# EAGLE design HA_CrankPhone (EAGLE 9.6.1)
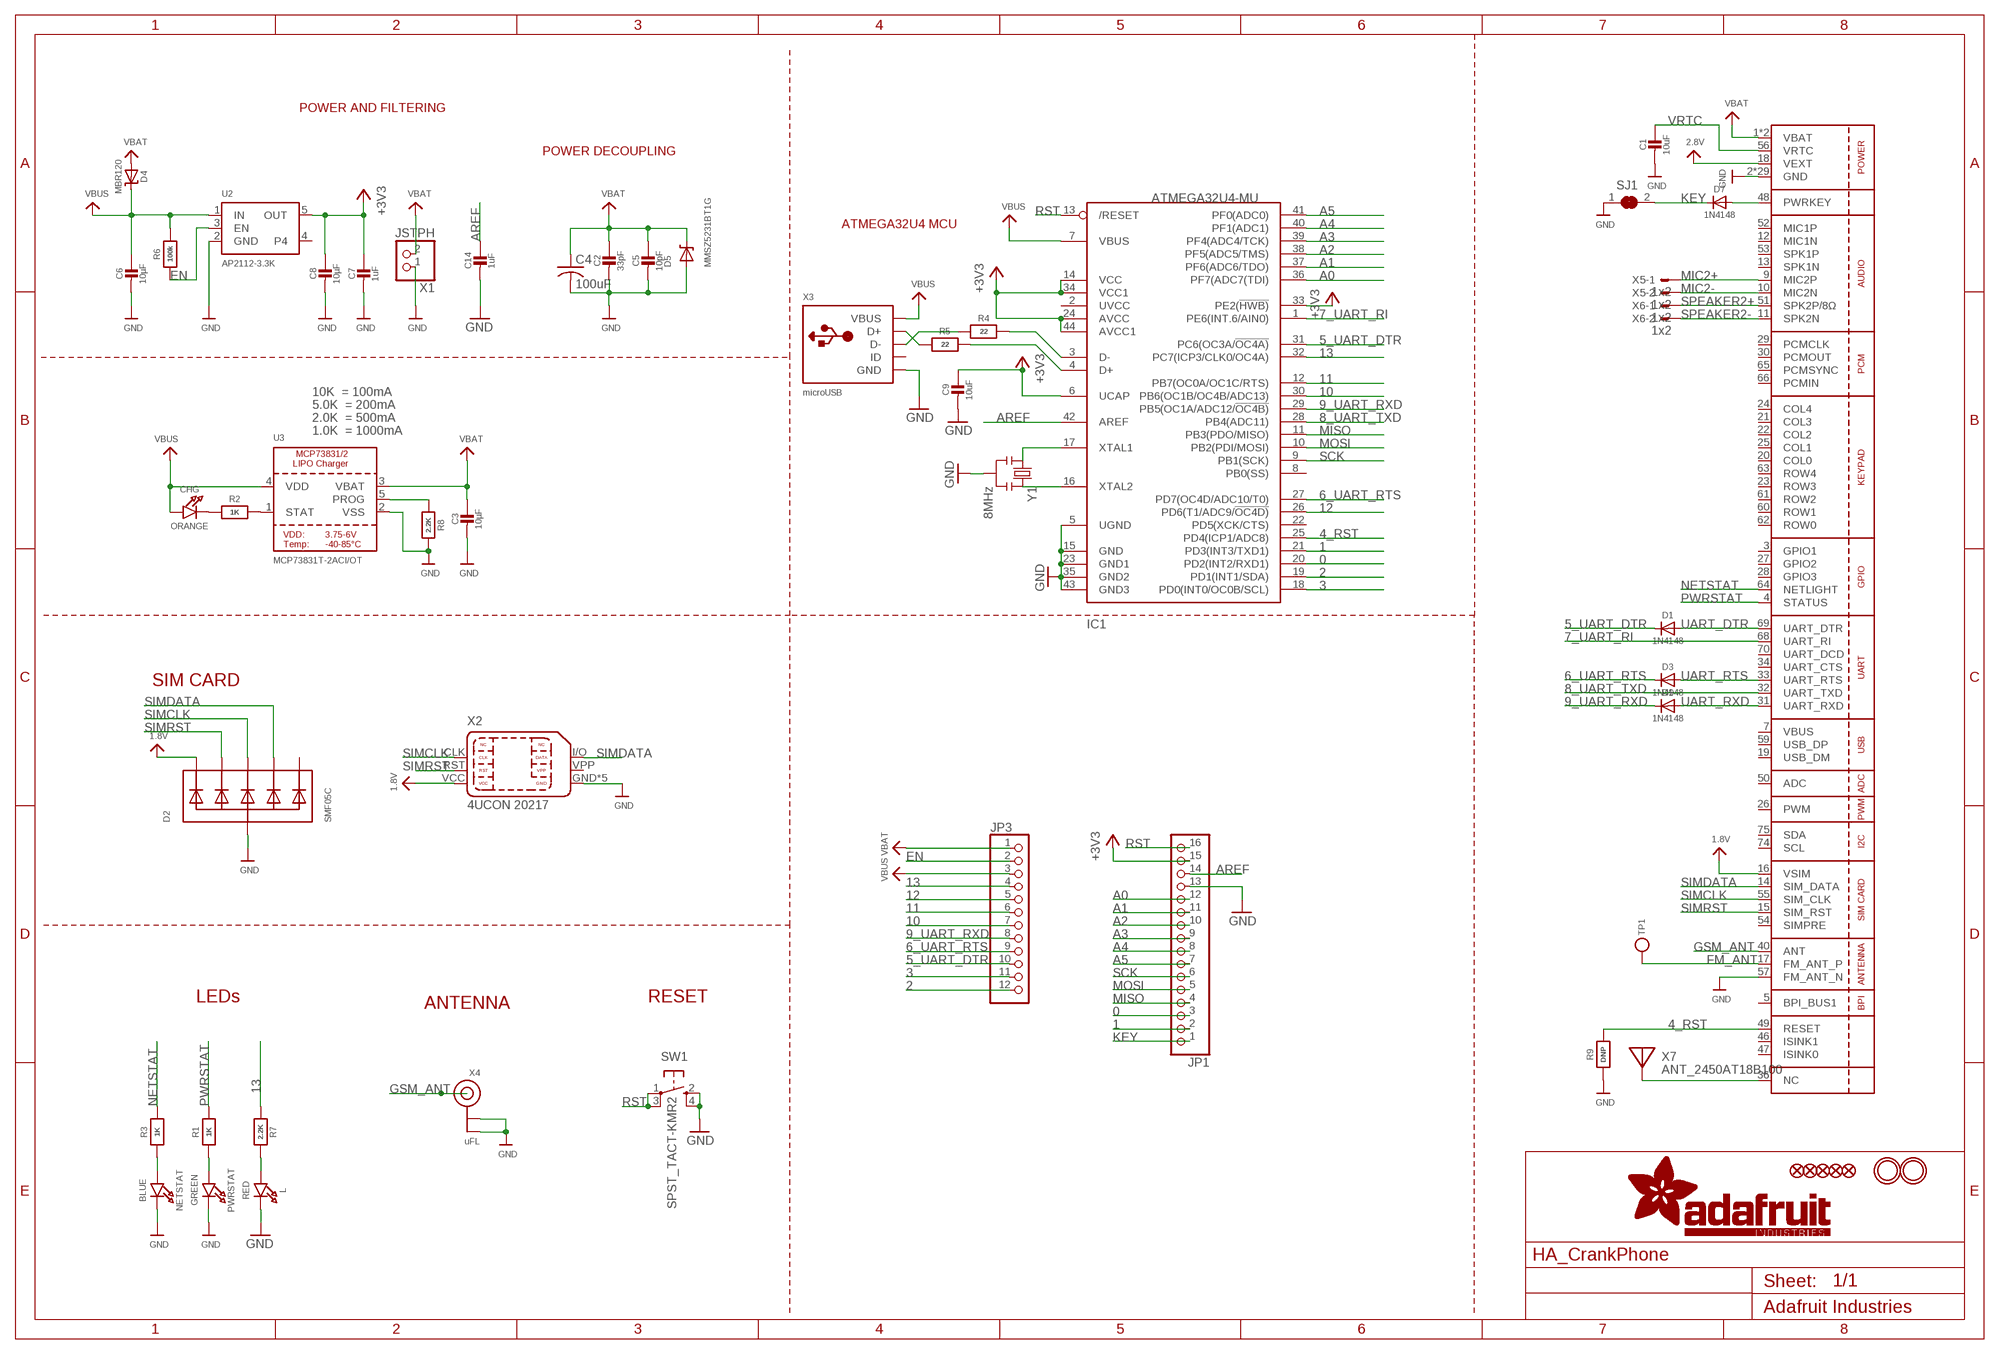
[diagram p0: schematic, sheet 1]

## Parts
C1  10uF  CAP_CERAMIC_0805MP  [_0805MP]
C2  33pF  CAP_CERAMIC0805-NOOUTLINE  [0805-NO]
C3  10µF  CAP_CERAMIC0805-NOOUTLINE  [0805-NO]
C4  100uF  C-USC1210  [C1210]
C5  10pF  CAP_CERAMIC0805-NOOUTLINE  [0805-NO]
C6  10µF  CAP_CERAMIC0805-NOOUTLINE  [0805-NO]
C7  1uF  CAP_CERAMIC0603_NO  [0603-NO]
C8  10µF  CAP_CERAMIC0805-NOOUTLINE  [0805-NO]
C9  10uF  CAP_CERAMIC_0805MP  [_0805MP]
C14  1uF  CAP_CERAMIC0603_NO  [0603-NO]
CHG  ORANGE  LED0805_NOOUTLINE  [CHIPLED_0805_NOOUTLINE]
D1  1N4148  DIODESOD-323  [SOD-323]
D2  SMF05C  TVSARRAY_5LANE  [SOT363]
D3  1N4148  DIODESOD-323  [SOD-323]
D4  MBR120  DIODE-SCHOTTKYSOD-123  [SOD-123]
D5  MMSZ5231BT1G  DIODE-ZENERSOD123  [SOD-123]
D7  1N4148  DIODESOD-323  [SOD-323]
D9  1N4148  DIODESOD-323  [SOD-323]
IC1  ATMEGA32U4-MU  [TQFN44_7MM]
JP1  HEADER-1X16ROUND  [1X16_ROUND]
JP3  HEADER-1X12  [1X12_ROUND]
L  RED  LED0805_NOOUTLINE  [CHIPLED_0805_NOOUTLINE]
NETSTAT  BLUE  LED0805_NOOUTLINE  [CHIPLED_0805_NOOUTLINE]
PWRSTAT  GREEN  LED0805_NOOUTLINE  [CHIPLED_0805_NOOUTLINE]
R1  1K  RESISTOR_0603_NOOUT  [0603-NO]
R2  1K  RESISTOR_0603_NOOUT  [0603-NO]
R3  1K  RESISTOR_0603_NOOUT  [0603-NO]
R4  22  RESISTOR_0603_NOOUT  [0603-NO]
R5  22  RESISTOR_0603_NOOUT  [0603-NO]
R6  100k  RESISTOR_0603_NOOUT  [0603-NO]
R7  2.2K  RESISTOR_0603_NOOUT  [0603-NO]
R8  2.2K  RESISTOR_0603_NOOUT  [0603-NO]
R9  DNP  RESISTOR_0603_NOOUT  [0603-NO]
SJ1  SOLDERJUMPER_CLOSED  [SOLDERJUMPER_CLOSEDWIRE]
SW1  SPST_TACT-KMR2  [KMR2]
TP1  TESTPOINTROUND1.5MM  [TESTPOINT_ROUND_1.5MM]
U1  SIM800H/L  GSM_SIM800L  [SIM800L]
U2  AP2112-3.3K  VREG_SOT23-5  [SOT23-5]
U3  MCP73831T-2ACI/OT  MCP73831/2  [SOT23-5]
U$18  FIDUCIAL""  [FIDUCIAL_1MM]
U$23  FIDUCIAL""  [FIDUCIAL_1MM]
U$31  MOUNTINGHOLE2.5  [MOUNTINGHOLE_2.5_PLATED]
U$32  MOUNTINGHOLE2.5  [MOUNTINGHOLE_2.5_PLATED]
U$34  FIDUCIAL""  [FIDUCIAL_1MM]
U$35  FIDUCIAL""  [FIDUCIAL_1MM]
U$42  FIDUCIAL""  [FIDUCIAL_1MM]
X1  JSTPH  CON_JST_PH_2PIN  [JSTPH2]
X2  4UCON 20217  SIM_MICRO  [4UCONN_20217]
X3  microUSB  USB_MICRO_20329_V2  [4UCONN_20329_V2]
X4  uFL  ANTENNA_U.FL  [U.FL]
X5  1x2  87758-0216  [87758-0216]
X6  1x2  87758-0216  [87758-0216]
X7  ANT_2450AT18B100  ANTENNA_JOHANSON_2450AT18B100  [ANT_2450AT18B100]
Y1  8MHz  RESONATORSMD  [RESONATOR-SMD]

## Nets
0: IC1.20(PD2(INT2/RXD1)) JP1.3
1: IC1.21(PD3(INT3/TXD1)) JP1.2
1.8V: D2.1(C1) U1.16(VSIM) X2.VCC
2: IC1.19(PD1(INT1/SDA)) JP3.12
2.8V: U1.18(VEXT)
3: IC1.18(PD0(INT0/OC0B/SCL)) JP3.11
4_RST: IC1.25(PD4(ICP1/ADC8)) R9.2 U1.49(RESET)
5_UART_DTR: D1.C IC1.31(PC6(OC3A/!OC4A)) JP3.10
6_UART_RTS: D3.C IC1.27(PD7(OC4D/ADC10/T0)) JP3.9
7_UART_RI: IC1.1(PE6(INT.6/AIN0)) U1.68(UART_RI)
8_UART_TXD: IC1.28(PB4(ADC11)) U1.32(UART_TXD)
9_UART_RXD: D9.C IC1.29(PB5(OC1A/ADC12/!OC4B)) JP3.8
10: IC1.30(PB6(OC1B/OC4B/ADC13)) JP3.7
11: IC1.12(PB7(OC0A/OC1C/RTS)) JP3.6
12: IC1.26(PD6(T1/ADC9/!OC4D)) JP3.5
13: IC1.32(PC7(ICP3/CLK0/OC4A)) JP3.4 R7.1
+3V3: C7.1 C8.1 C9.1 IC1.6(UCAP) IC1.14(VCC) IC1.24(AVCC) IC1.33(PE2(!HWB)) IC1.34(VCC1) IC1.44(AVCC1) JP1.15 U2.5(OUT)
A0: IC1.36(PF7(ADC7(TDI)) JP1.12
A1: IC1.37(PF6(ADC6/TDO)) JP1.11
A2: IC1.38(PF5(ADC5/TMS)) JP1.10
A3: IC1.39(PF4(ADC4/TCK)) JP1.9
A4: IC1.40(PF1(ADC1)) JP1.8
A5: IC1.41(PF0(ADC0)) JP1.7
AREF: C14.1 IC1.42(AREF) JP1.14
D+: IC1.4(D+) R5.2
D-: IC1.3(D-) R4.2
EN: JP3.2 R6.1 U2.3(EN)
FM_ANT: TP1.P$1 U1.17(FM_ANT_P)
GND: C1.2 C2.2 C3.2 C4.2 C5.2 C6.2 C7.2 C8.2 C9.2 C14.2 D2.2(A) D5.A IC1.5(UGND) IC1.15(GND) IC1.23(GND1) IC1.35(GND2) IC1.43(GND3) JP1.13 L.C NETSTAT.C PWRSTAT.C R8.2 R9.1 SJ1.1 SW1.2(S) SW1.4(S1) U1.2(GND) U1.6(GND) U1.8(GND) U1.35(GND) U1.37(GND) U1.38(GND) U1.39(GND) U1.41(GND) U1.43(GND) U1.44(GND) U1.45(GND) U1.57(FM_ANT_N) U1.58(GND) U1.67(GND) U1.71(GND) U1.72(GND) U1.73(GND) U1.76(GND) U1.77(GND) U1.78(GND) U1.79(GND) U1.80(GND) U1.81(GND) U1.82(GND) U1.83(GND) U1.84(GND) U1.85(GND) U1.86(GND) U1.87(GND) U1.88(GND) U2.2(GND) U3.2(VSS) X1.1 X2.GND X2.GND@1(GND) X2.GND@2(GND) X2.GND@3(GND) X2.GND@4(GND) X3.BASE@1(GND) X3.BASE@2(GND) X3.GND X3.SPRT@1(GND) X3.SPRT@2(GND) X3.SPRT@3(GND) X3.SPRT@4(GND) X4.1(GND) X4.2(GND) Y1.2
GSM_ANT: U1.40(ANT) X4.3(SIGNAL)
KEY: D7.C JP1.1 SJ1.2
MIC2+: U1.9(MIC2P) X5.1
MIC2-: U1.10(MIC2N) X5.2
MISO: IC1.11(PB3(PDO/MISO)) JP1.4
MOSI: IC1.10(PB2(PDI/MOSI)) JP1.5
N$1: CHG.C R2.1
N$2: L.A R7.2
N$3: R2.2 U3.1(STAT)
N$4: R8.1 U3.5(PROG)
N$5: PWRSTAT.A R1.1
N$6: U1.36(NC) X7.FP
N$7: D7.A U1.48(PWRKEY)
N$9: NETSTAT.A R3.1
N$11: IC1.16(XTAL2) Y1.3
N$12: IC1.17(XTAL1) Y1.1
N$15: R5.1 X3.D+
N$16: R4.1 X3.D-
NETSTAT: R3.2 U1.64(NETLIGHT)
PWRSTAT: R1.2 U1.4(STATUS)
RST: IC1.13(/RESET) JP1.16 SW1.1(P) SW1.3(P1)
SCK: IC1.9(PB1(SCK)) JP1.6
SIMCLK: D2.4(C3) U1.55(SIM_CLK) X2.CLK
SIMDATA: D2.5(C4) U1.14(SIM_DATA) X2.I/O(DATA)
SIMRST: D2.3(C2) U1.15(SIM_RST) X2.RST
SPEAKER2+: U1.51(SPK2P/8Ω) X6.1
SPEAKER2-: U1.11(SPK2N) X6.2
UART_DTR: D1.A U1.69(UART_DTR)
UART_RTS: D3.A U1.33(UART_RTS)
UART_RXD: D9.A U1.31(UART_RXD)
VBAT: C2.1 C3.1 C4.1 C5.1 D4.A D5.C JP3.1 U1.1(VBAT) U1.42(VBAT) U3.3(VBAT) X1.2
VBUS: C6.1 CHG.A D4.C IC1.7(VBUS) JP3.3 R6.2 U2.1(IN) U3.4(VDD) X3.VBUS
VRTC: C1.1 U1.56(VRTC)
Unconnected: D2.6(C5) IC1.2(UVCC) IC1.8(PB0(SS)) IC1.22(PD5(XCK/CTS)) U1.3(GPIO1) U1.5(BPI_BUS1) U1.12(MIC1N) U1.13(SPK1N) U1.19(USB_DM) U1.20(COL0) U1.21(COL3) U1.22(COL2) U1.23(ROW3) U1.24(COL4) U1.25(COL1) U1.26(PWM) U1.27(GPIO2) U1.28(GPIO3) U1.29(PCMCLK) U1.30(PCMOUT) U1.34(UART_CTS) U1.46(ISINK1) U1.47(ISINK0) U1.50(ADC) U1.52(MIC1P) U1.53(SPK1P) U1.54(SIMPRE) U1.59(USB_DP) U1.60(ROW1) U1.61(ROW2) U1.62(ROW0) U1.63(ROW4) U1.65(PCMSYNC) U1.66(PCMIN) U1.70(UART_DCD) U1.74(SCL) U1.75(SDA) U2.4 X2.VPP X3.ID

## Notes on the sheet
- POWER AND FILTERING
- POWER DECOUPLING
- ATMEGA32U4 MCU
- 10K  = 100mA
- 5.0K  = 200mA
- 2.0K  = 500mA
- 1.0K  = 1000mA
- SIM CARD
- LEDs | ANTENNA | RESET

## Power pins joined to a net without a drawn wire
VBUS: U1.7(VBUS)

## Library data of the parts
C1-C3 C5-C9 C14 = microbuilder:CAP_CERAMIC: Ceramic Capacitors For new designs, use the packages preceded by an '_' character since they are more reliable: The following footprints should be used on most boards: _0402 - Standard footprint for regular board layouts _0603 - Standard footprint for regular board layouts _0805 - Standard footprint for regular board layouts _1206 - Standard footprint for regular board layouts For extremely tight-pitch boards where space is at a premium, the following 'micro-pitch' footprints can be used (smaller pads, no silkscreen outline, etc.): _0402MP - Micro-pitch footprint for very dense/compact boards _0603MP - Micro-pitch footprint for very dense/compact boards _0805MP - Micro-pitch footprint for very dense/compact boards _1206MP - Micro-pitch footprint for very dense/compact boards
C4 = rcl:C-US: CAPACITOR, American symbol
CHG L NETSTAT PWRSTAT = microbuilder:LED: LED 0603 - 0603 Surface Mount Package 2mA: Green LED - Low Power (3.9mcd, 2ma, 1.7Vf) - Digikey: 475-2709-2-ND Orange LED - Low Power (9.8mcd, 2ma, 1.8Vf) - Digikey: 475-1194-2-ND Red LED - Low Power (5mcd, 2ma, 1.8Vf) - Digikey: 475-1195-2-ND Yellow LED - Low Power (7mcd, 2ma, 1.8Vf) - Digikey: 475-1196-2-ND 5mA: Blue LED - Low Power (17mcd, 5ma, 2.9Vf) - Digikey: LNJ937W8CRACT-ND 0805 - 0805 Surface Mount Package 2mA: Red LED (8.8mcd, 2mA, 1.8Vf, Clear) - Low Power [Digikey: 475-2510-1-ND] Green LED (5mcd, 2mA, 1.8Vf, Clear) - Low Power [Digikey: 475-2730-1-ND] Yellow LED (11.3mcd, 2mA, 1.8Vf, Clear) - Low Power [Digikey: 475-2555-1-ND] 20mA: Red LED (104mcd, 20mA, Diffused) - LS R976 [Digikey: 475-1278-6-ND] Red LED (12mcd, 20mA, 2.0Vf, Clear) - APT2012EC [Digikey: 754-1128-1-ND] Green LED (15mcd, 20mA, 2.2Vf, Clear) - APT2012GC [Digikey: 754-1131-1-ND] Orange LED (160mcd, 20mA, 2.1Vf, Clear) - APT2012SECK [Digikey: 754-1130-1-ND] 1206 - 1206 Surface Mount Package Green LED (26mcd, 20mA, Diffused) - LG N971 [Digikey: 475-1407-6-ND] Red LED (15mcd, 20mA, Diffused) - LH N974 [Digikey: 475-1416-6-ND] Cree - Cree High-Power Surface Mount LEDs XPEBWT-L1-0000-00D50 - White 111lm 350mA 2.9Vf 6200K 110° XTEAWT-00-0000-00000LEE3 - White 114lm 350mA 2.85Vf 5000K 115° Everlight - Everlight 45-21 Series Surface Mount LEDs 45-21/QK2C-B2832AC2CB2/2T - Warm White 2000mcd 20mA 3.25Vf 3050K 120° 45-21/LK2C-B38452C4CB2/2T - Nuetral White 2000mcd 20mA 3.25Vf 4150K 120° 45-21/LK2C-B50634C6CB2/2T - Cold White 2200mcd 20mA 3.25Vf 5650K 120° PLCC2 Reverse Mount LS T77K-J1L2-1-0-2-R18-Z - Red 11.25mcd 2mA 1.8Vf 630nm 120° LO T77K-L1M2-24-Z - Orange 19.6mcd 2mA 1.8Vf 606nm 120° LY T77K-K2M1-26-Z - Yellow 15.7mcd 2mA 1.8Vf 587nm 120°
D1 D3 D7 D9 = microbuilder:DIODE: Diode SMA Model Volts Amps Type Vf Ir Digikey # Notes SSA34-E3 40V 3A Schottky 480mV @ 3A 200uA @ 40V SSA34-E3/61TGITR-ND CDBA120-G 20V 1A Schottky 500mV @ 1A 500uA @ 20V 641-1014-6-ND REEL MBRA210 10V 2A Schottky 350mV @ 2A 700uA @ 10V MBRA210LT3 SOD-123 Model Volts Amps Type Vf Ir Order # Notes BAT54T1G 30V 200mA Schottky 800mV @ 200mA 2uA @ 25V BAT54T1GOSTR-ND B0530W 30V 500mA Schottky 430mV @ 500mA 130uA @ 30V B0530W-FDICT-ND REEL MBR120 20V 1A Schottky 340mV @ 1A MBR120VLSFT1GOSCT-ND SOD-323 Model Volts Amps Type Vf Ir Order # Notes PMEG2005EJ 20V 500mA Schottky 355mV @ 500mA 568-4110-1-ND ZLLS410 10V 570mA Schottky 380mV @ 570mA ZLLS410CT-ND 1N4148WS 75V 150mA Silicon/Simple 1V 1N4148WSFSCT-ND REEL SOD-523 Model Volts Amps Type Vf Ir Order # Notes BAT54XV2 30V 200mA Schottky 0.8V @ 100mA BAT54XV2CT-ND TB751S 30V 30mA Schottky RB751S-40TE61CT-ND SOT23-R/W (R = Solder Paste/Reflow Ovens, W = Hand-Soldering) Model Volts Amps Type Vf Ir Order # Notes BAT54FILM 40V 300mA Schottky 497-7162-1-ND POWERDI-5 Model Volts Amps Type Vf Ir Order # Notes PDS560 60V 5A Schottky 670mV @ 5A 150uA @ 60V PDS560DICT-ND
D2 = microbuilder:TVSARRAY_5LANE: Voltage Transient Suppressor Array SOT363 SMF05C - 100W 5V: Digikey - SMF05CT1GOSCT-ND
D4 = microbuilder:DIODE-SCHOTTKY
D5 = microbuilder:DIODE-ZENER: Zener Diode SMA: 30V 1W Zener Diode, 1.2Vf - Digikey: SMAZ30-FDICT-ND
IC1 = microbuilder:ATMEGA32U4: http://www.ladyada.net/library/eagle
JP1 = microbuilder:HEADER-1X16: PIN HEADER
JP3 = microbuilder:HEADER-1X12
R1-R9 = microbuilder:RESISTOR: Resistors For new designs, use the packages preceded by an '_' character since they are more reliable: The following footprints should be used on most boards: _0402 - Standard footprint for regular board layouts _0603 - Standard footprint for regular board layouts _0805 - Standard footprint for regular board layouts _1206 - Standard footprint for regular board layouts For extremely tight-pitch boards where space is at a premium, the following 'micro-pitch' footprints can be used (smaller pads, no silkscreen outline, etc.): _0402MP - Micro-pitch footprint for very dense/compact boards _0603MP - Micro-pitch footprint for very dense/compact boards _0805MP - Micro-pitch footprint for very dense/compact boards _1206MP - Micro-pitch footprint for very dense/compact boards
SJ1 = microbuilder:SOLDERJUMPER_CLOSED: Solder Jumper - Closed These solder jumpers are closed by default CLOSEDWIRE - 10 mil trace between pads that can be cut and resoldered later CLOSEDPERM - 63 mil trace between pads for a permanent connection (used to 'bridge' two signals, a shameless hack for Eagle). Can double as a test point as well (no cream layer)
SW1 = adafruit:SPST_TACT: SMT 6mm switch, EVQQ2 series http://www.ladyada.net/library/eagle
TP1 = microbuilder:TESTPOINT: Test Point Various test points for characterisation and PCB testing TESTPOINT_SMT - Compact Surface Mount Test Point [Digikey: 5016KTR-ND]
U1 = microbuilder:GSM_SIM800L: SIM800K Quad-Band GSM/GPRS Module 850/900/1800/1900 MHz Bluetooth EDR (3.0) FM Band: 76-109MHz (50kHz steps) -40 - 85°C
U2 = microbuilder:VREG_SOT23-5: SOT23-5 Fixed Voltage Regulators Part Current Out V Out V In V Dropout θJA (°C/W) TJ (°C) Digikey Part No. ADP121 150mA 3.3V 3.4-5.5V 0.09V @ 150mA -- -- ADP121-AUJZ33R7CT-ND ADP121 150mA 3.0V 3.1-5.5V 0.09V @ 150mA -- -- ADP121-AUJZ30R7CT-ND ADP122 300mA 3.3V 3.4-5.5V 0.085V @ 300mA -- -- ADP122AUJZ-3.3-R7CT-ND ADP1712 300mA 3.3V 3.5-5.5V 0.17V @ 300mA -- -- ADP1712AUJZ-3.3-R7TR-ND AP7311 (Low Cost) 150mA 3.3V 3.5-6V 0.15V @ 150mA -- -- AP7311-33WG-7DICT-ND LD39015M18R 150mA 1.8V 1.9V-5.5V 0.08V @ 100mA -- -- 497-6977-1-ND LP2985A-33DBVR 150mA 3.3V 3.3-16V 0.28V @ 150mA 206 150 296-18479-1-ND MCP1824T-3302E/OT 300mA 3.3V 3.5V-6V 0.2V @ 300mA -- -- MCP1824T-3302E/OTCT-ND MIC5205-2.5YM5 TR 150mA 2.5V 2.7-16V 0.165V @ 150mA -- -- 576-1257-2-ND MIC5205-3.0YM5 TR 150mA 3.0V 3.2V-16V 0.165V @ 150mA -- -- 576-1258-2-ND MIC5205-3.3YM5 TR 150mA 3.3V 3.5V-16V 0.165V @ 150mA -- -- 576-1259-2-ND TPS780330220 150mA 3.3V+2.2V 3.6-5.5V 250mV Max -- -- 296-23332-1-ND TDA3663/N1,135 100mA 3.3V 3.5-45V 0.18V @ 50mA -- -- 568-5343-1-ND Max operating temp can be calculated using θJA, TJ (max junction temperature), and power in watts. Set the "Maximum Ambient Temperature" until it reaches TJ ("Max Junction Temperature"), which is the absolute limit for safe use of the regulator: Heat Sink Temperature Calculator <http://www.daycounter.com/Calculators/Heat-Sink-Temperature-Calculator.phtml> For example, With 12V source into a 3.3V LP2985 and a 30mA load, we are dissipating (12V-3.3V) * 0.03A = 0.261W. With a θJA of 206 °C/W, a TJ of 150°C, and 261mW we can safely use the chip without a heat sink up to 75°C (=147.1°C Junction Temperature).
U3 = microbuilder:MCP73831/2: MCP73831/2 LIPO Charger VDD: 3.75 - 6V Temp -40 - 85°C Programmable Charge Rate: 15-500mA NOTE: STAT is a tri-state logic output on the MCP73831 and an open-drain output on the MCP73832. SOT23-5 with 4.2V output and tri-state logic on STAT = MCP73831T-2ACI/OT
U$18 U$23 U$34 U$35 U$42 = microbuilder:FIDUCIAL: Fiducial Alignment Points Various fiducial points for machine vision alignment.; BOM: EXCLUDE
U$31 U$32 = microbuilder:MOUNTINGHOLE: Mounting Hole For #2 screws (0.086"/2.18mm width, 0.094"/2.4mm hole) use 2.5mm; BOM: EXCLUDE
X1 = microbuilder:CON_JST_PH_2PIN: JST 2-Pin Right-Angle Connector PH-Series - 4UConnector: 17311 SH-Series - 4UConnector: 07278
X2 = microbuilder:SIM_MICRO: Micro SIM Card Holder 78723-1001 = Molex Push/Pull connector (8-Pin)
X3 = microbuilder:USB: USB Connectors USBMINIB - Surface Mount Female Mini-B USB Connector 4UConnector: 06564
X4 = microbuilder:ANTENNA_U.FL: U.FL Antenna Connector
X5 X6 = con-molex:87758-0216: 2 Pin - 2mm Dual Row Single Wafer, Vertical T/H HDR Source: http://www.molex.com/pdm_docs/sd/877580616_sd.pdf; MPN: 87758-0216; OC_FARNELL: unknown; OC_NEWARK: 94M1513
X7 = microbuilder:ANTENNA_JOHANSON_2450AT18B100: Johanson 2.4GHz Chip Antenna (1206 Package) Frequency Range: 2400 - 2500 Mhz Peak Gain 0.5 dBi typ. (XZ-V) Average Gain -0.5 dBi typ. (XZ-V) Input Power 3W max. Operating Temperature -40 to +85°C Digikey: 712-1006-1-ND
Y1 = SparkFun:RESONATOR: Resonator Small SMD resonator. This is the itty bitty 10/20MHz resonators with built in caps. CSTCE10M0G55 and CSTCE20M0V53. Footprint has been reviewed closely but hasn't been tested yet.

## Net classes
0 default: clearance 0.205 mm

## Board
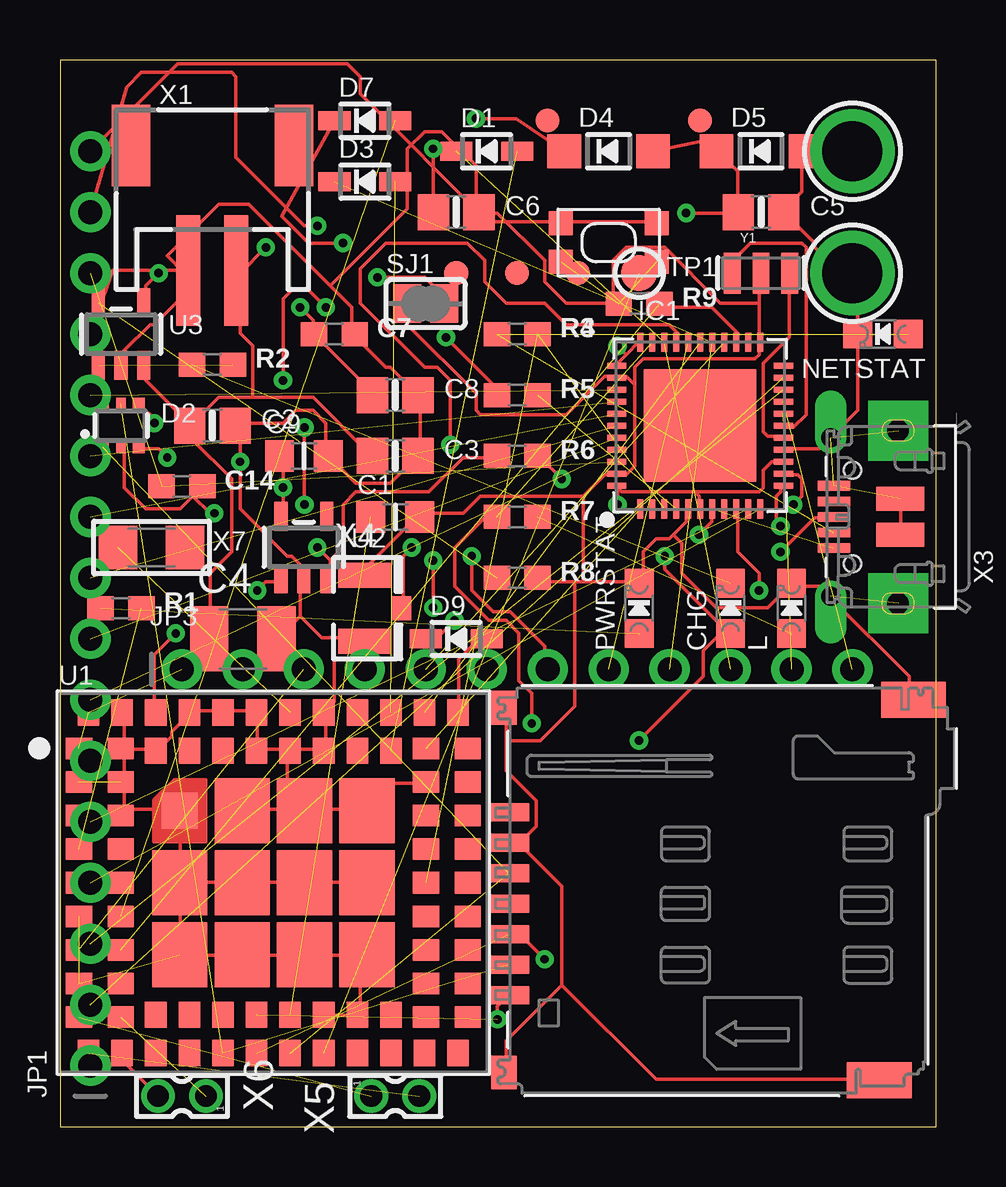
[diagram p1: board, top side]
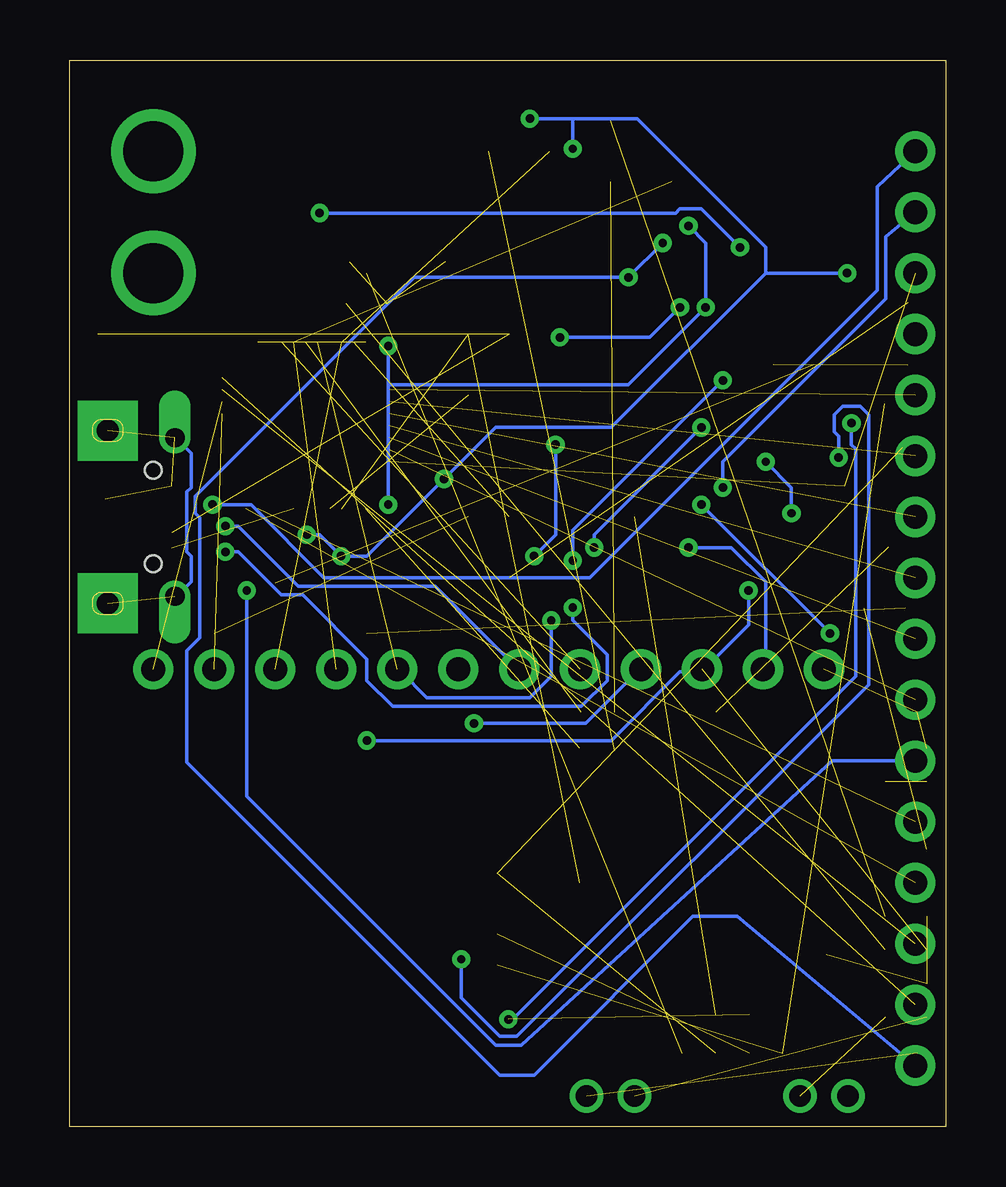
[diagram p2: board, bottom side, seen from below]

Size 36.5 x 44.44 mm. Coordinates in mm from the lower left corner, seen from the top.
Outline: 0,0 36.5,0 36.5,44.44 0,44.44 0,0
Copper layers (1*16): Top 0.035mm / dielectric 1.5mm / Bottom 0.035mm
Design rules "default": minimum track width 6mil, minimum drill 0.35mm, track to track 6mil, track to pad 6mil, pad to pad 6mil, via to via 6mil, smd to smd 6mil, copper to edge 40mil, drill to drill 6mil, minimum pad ring 10mil, minimum via ring 8mil, stop-mask expansion 4mil, vias tented up to drill 0mil, thermal gap 10mil

### Footprints (pad centres in the part's own frame; a part is rotated, then mirrored left to right if it is on the bottom)
_0805MP = smd 1.2 x 1.3: 1 -1.016,0; 2 1.016,0
0805-NO = smd 1.3 x 1.5: 1 -0.95,0; 2 0.95,0
C1210 = smd 1.6 x 2.7: 1 -1.4,0; 2 1.4,0
0603-NO = smd 1.1 x 1: 1 -0.85,0; 2 0.85,0
CHIPLED_0805_NOOUTLINE = smd 1.2 x 1.2: A 0,-1.05; C 0,1.05
SOD-323 = smd 1.35 x 0.8: A 1.27,0; C -1.27,0
SOT363 = smd 0.5 x 0.5: 1 -0.75,-0.9; 3 0.75,-0.9; 4 0.75,0.9; 6 -0.75,0.9 | smd 0.4 x 0.5: 2 0,-0.9; 5 0,0.9
SOD-123 = smd 1.4 x 1.4: A 1.85,0; C -1.85,0
TQFN44_7MM = smd 0.25 x 0.8: 1 -2.5,-3.475; 2 -2,-3.475; 3 -1.5,-3.475; 4 -1,-3.475; 5 -0.5,-3.475; 6 0,-3.475; 7 0.5,-3.475; 8 1,-3.475; 9 1.5,-3.475; 10 2,-3.475; 11 2.5,-3.475; 23 2.5,3.475; 24 2,3.475; 25 1.5,3.475; 26 1,3.475; 27 0.5,3.475; 28 0,3.475; 29 -0.5,3.475; 30 -1,3.475; 31 -1.5,3.475; 32 -2,3.475; 33 -2.5,3.475 | smd 0.8 x 0.25: 12 3.475,-2.5; 13 3.475,-2; 14 3.475,-1.5; 15 3.475,-1; 16 3.475,-0.5; 17 3.475,0; 18 3.475,0.5; 19 3.475,1; 20 3.475,1.5; 21 3.475,2; 22 3.475,2.5; 34 -3.475,2.5; 35 -3.475,2; 36 -3.475,1.5; 37 -3.475,1; 38 -3.475,0.5; 39 -3.475,0; 40 -3.475,-0.5; 41 -3.475,-1; 42 -3.475,-1.5; 43 -3.475,-2; 44 -3.475,-2.5 | smd 4.7 x 4.7: THERMAL 0,0
1X16_ROUND = drill 1 pad 1.676: 1 -19.05,0; 2 -16.51,0; 3 -13.97,0; 4 -11.43,0; 5 -8.89,0; 6 -6.35,0; 7 -3.81,0; 8 -1.27,0; 9 1.27,0; 10 3.81,0; 11 6.35,0; 12 8.89,0; 13 11.43,0; 14 13.97,0; 15 16.51,0; 16 19.05,0
1X12_ROUND = drill 1 pad 1.676: 1 -13.97,0; 2 -11.43,0; 3 -8.89,0; 4 -6.35,0; 5 -3.81,0; 6 -1.27,0; 7 1.27,0; 8 3.81,0; 9 6.35,0; 10 8.89,0; 11 11.43,0; 12 13.97,0
SOLDERJUMPER_CLOSEDWIRE = smd 1.168 x 1.6: 1 -0.762,0; 2 0.762,0 | smd 0.635 x 0.203: WIRE 0,0
KMR2 = smd 1 x 1: 1 2,0.8; 2 2,-0.8; 3 -2,0.8; 4 -2,-0.8
TESTPOINT_ROUND_1.5MM = smd 1.5 x 1.5: P$1 0,0
SIM800L = smd 1.1 x 0.9: 1 -8.1,5.6; 2 -8.1,4.2; 3 -8.1,2.8; 4 -8.1,1.4; 5 -8.1,0; 6 -8.1,-1.4; 7 -8.1,-2.8; 8 -8.1,-4.2; 9 -8.1,-5.6; 22 8.1,-5.6; 23 8.1,-4.2; 24 8.1,-2.8; 25 8.1,-1.4; 26 8.1,0; 27 8.1,1.4; 28 8.1,2.8; 29 8.1,4.2; 30 8.1,5.6; 43 -6.36,5.6; 44 -6.36,4.2; 45 -6.36,2.8; 46 -6.36,1.4; 47 -6.36,0; 48 -6.36,-1.4; 49 -6.36,-2.8; 50 -6.36,-4.2; 51 -6.36,-5.6; 60 6.36,-5.6; 61 6.36,-4.2; 62 6.36,-2.8; 63 6.36,-1.4; 64 6.36,0; 65 6.36,1.4; 66 6.36,2.8; 67 6.36,4.2; 68 6.36,5.6 | smd 0.9 x 1.1: 10 -7.7,-7.1; 11 -6.3,-7.1; 12 -4.9,-7.1; 13 -3.5,-7.1; 14 -2.1,-7.1; 15 -0.7,-7.1; 16 0.7,-7.1; 17 2.1,-7.1; 18 3.5,-7.1; 19 4.9,-7.1; 20 6.3,-7.1; 21 7.7,-7.1; 31 7.7,7.1; 32 6.3,7.1; 33 4.9,7.1; 34 3.5,7.1; 35 2.1,7.1; 36 0.7,7.1; 37 -0.7,7.1; 38 -2.1,7.1; 39 -3.5,7.1; 40 -4.9,7.1; 41 -6.3,7.1; 42 -7.7,7.1; 52 -4.9,-5.5; 53 -3.5,-5.5; 54 -2.1,-5.5; 55 -0.7,-5.5; 56 0.7,-5.5; 57 2.1,-5.5; 58 3.5,-5.5; 59 4.9,-5.5; 69 4.9,5.5; 70 3.5,5.5; 71 2.1,5.5; 72 0.7,5.5; 73 -0.7,5.5; 74 -2.1,5.5; 75 -3.5,5.5; 76 -4.9,5.5 | smd 1.5 x 1.5: 77 -3.9,3 | smd 2.3 x 2.7: 78 -3.9,0; 79 -3.9,-3; 80 -1.3,-3; 81 1.3,-3; 82 3.9,-3; 83 3.9,0; 84 3.9,3; 85 1.3,3; 86 -1.3,3; 87 -1.3,0; 88 1.3,0
SOT23-5 = smd 0.55 x 1.2: 1 -0.95,-1.3; 2 0,-1.3; 3 0.95,-1.3; 4 0.95,1.3; 5 -0.95,1.3
FIDUCIAL_1MM = smd 1 x 1: 1 0,0
MOUNTINGHOLE_2.5_PLATED = drill 2.5 pad 3.2: P$1 0,0
JSTPH2 = smd 1 x 4.6: 1 -1,-3.7; 2 1,-3.7 | smd 1.6 x 3.4: NC1 -3.4,1.5; NC2 3.4,1.5
4UCONN_20217 = smd 0.75 x 1.7: CLK -12.31,16.86; GND -5.96,16.86; I/O -11.04,16.86; RST -9.77,16.86; SW -4.69,16.86; VCC -7.23,16.86; VPP -8.5,16.86 | smd 1.4 x 1.05: GND@1 -15.53,17.06; GND@4 -0.33,17.06 | smd 1.5 x 2.7: GND@2 -15.86,1.42; GND@3 0,0
4UCONN_20329_V2 = smd 1 x 2: BASE@1 -0.75,-2; BASE@2 0.75,-2 | smd 0.4 x 1.35: D+ 0,0.775; D- -0.65,0.775; GND 1.3,0.775; ID 0.65,0.775; VBUS -1.3,0.775 | drill 0.8 pad 1.2 offset: SPRT@1 -3.3,0.9; SPRT@2 3.3,0.9 | drill 0.9 pad 2.5 square: SPRT@3 -3.6,-1.9; SPRT@4 3.6,-1.9 | hole 0.7: -1.95,0; 1.95,0
U.FL = smd 2.2 x 1.05: 1 0,1.375; 2 0,-1.375 | smd 0.8 x 1: 3 1.525,0
87758-0216 = drill 0.9 pad 1.27: 1 0,-1; 2 0,1
ANT_2450AT18B100 = smd 1.6 x 1.8: FP -1.4,0; NC 1.4,0
RESONATOR-SMD = smd 0.7 x 1.7: 1 -1.2,0; 2 0,0; 3 1.2,0

### Placement (x,y rotation side)
C1  13.97,25.4 0 top
C2  6.35,29.21 0 top
C3  13.97,27.94 0 top
C4  7.62,20.32 0 top
C5  29.21,38.1 0 top
C6  16.51,38.1 0 top
C7  11.43,33.02 0 top
C8  13.97,30.48 0 top
C9  10.16,27.94 0 top
C14  5.08,26.67 0 top
CHG  27.94,21.59 0 top
D1  17.78,40.64 0 top
D2  2.54,29.21 0 top
D3  12.7,39.37 0 top
D4  22.86,40.64 0 top
D5  29.21,40.64 0 top
D7  12.7,41.91 0 top
D9  16.51,20.32 0 top
IC1  26.67,29.21 0 top
JP1  1.27,21.59 90 top
JP3  19.05,19.05 0 top
L  30.48,21.59 0 top
NETSTAT  34.29,33.02 90 top
PWRSTAT  24.13,21.59 0 top
R1  2.54,21.59 0 top
R2  6.35,31.75 0 top
R3  19.05,33.02 0 top
R4  19.05,33.02 0 top
R5  19.05,30.48 0 top
R6  19.05,27.94 0 top
R7  19.05,25.4 0 top
R8  19.05,22.86 0 top
R9  24.13,34.29 0 top
SJ1  15.24,34.29 0 top
SW1  22.86,36.83 0 top
TP1  24.13,35.56 0 top
U1  8.89,10.16 0 top
U2  10.16,24.13 0 top
U3  2.54,33.02 0 top
U$18  21.59,35.56 0 top
U$23  19.05,35.56 0 top
U$31  33.02,35.56 0 top
U$32  33.02,40.64 0 top
U$34  16.51,35.56 0 top
U$35  20.32,41.91 0 top
U$42  26.67,41.91 0 top
X1  6.35,39.37 0 top
X2  35.56,17.78 90 top
X3  33.02,25.4 90 top
X4  12.7,21.59 0 top
X5  13.97,1.27 270 top
X6  5.08,1.27 90 top
X7  3.81,24.13 0 top
Y1  29.21,35.56 0 top

### Tracks (layer width: path | path; a pad name or v marks a point on that pad's centre or on a via)
0  (1 unrouted)
1  (1 unrouted)
1.8V  (2 unrouted)
2  (1 unrouted)
3  (1 unrouted)
4_RST  (1 unrouted)
  Top 0.152: IC1.25 28.23,32.7 28.23,33.06 27.16,34.13 25.02,34.13 R9.2
5_UART_DTR  (2 unrouted)
6_UART_RTS  (2 unrouted)
7_UART_RI  (1 unrouted)
8_UART_TXD  (1 unrouted)
9_UART_RXD  (via drill 0.35)  (1 unrouted)
  Top 0.152: v16.44,21.09 15.73,20.37 15.37,20.37 D9.C
  Bottom 0.152: v16.44,21.09 16.44,18.76 17.33,17.87 21.62,17.87 22.7,18.94 JP3.8
10  (via drill 0.35)
  Top 0.152: v16.26,28.41 16.26,31.09 15.73,31.63 15.19,31.63 12.51,34.31 12.51,35.74 13.58,36.81 16.98,36.81 17.69,36.1 17.69,35.2 18.59,34.31 20.19,34.31 21.09,33.42 25.38,33.42 25.73,33.06 25.73,32.7 IC1.30 | v17.16,23.77 17.16,22.34 18.05,21.44 18.76,21.44 20.19,20.01 20.19,19.12 JP3.7
  Bottom 0.152: v16.26,28.41 16.26,24.66 v17.16,23.77
11  (via drill 0.35)
  Top 0.152: v30.02,25.02 29.84,25.2 29.84,26.27 30.02,26.45 30.02,26.63 IC1.12
  Bottom 0.152: v30.02,25.02 29.48,25.02 26.98,22.52 21.27,22.52 17.87,19.12 JP3.6
12  (1 unrouted)
13  (via drill 0.35)  (1 unrouted)
  Top 0.152: v19.66,16.8 19.66,18.05 19.12,18.59 19.12,20.55 18.59,21.09 17.87,21.09 16.44,22.52 16.44,24.12 17.69,25.38 18.05,25.38 R7.1
  Bottom 0.152: v19.66,16.8 15.01,16.8 12.87,18.94 JP3.4
+3V3  (via drill 0.35)  (1 unrouted)
  Top 0.152: C8.1 13.04,30.56 10.72,32.88 C7.1 10.54,33.06 10.54,33.6 v10.01,34.13 | 23.59,32.17 24.12,32.7 IC1.33 | 23.59,32.17 23.23,31.81 IC1.34 | 26.45,26.45 26.63,26.27 26.63,25.91 IC1.6 | 26.45,26.45 23.41,26.45 23.23,26.63 | 26.45,26.45 29.13,26.45 29.31,26.63 29.31,27.34 29.66,27.7 30.02,27.7 IC1.14 | v23.23,32.52 23.59,32.17 | 23.23,26.63 v23.23,25.91 | 23.23,26.63 IC1.44 | U2.5 9.29,25.55 v9.29,26.63 9.29,27.88 C9.1 | v10.72,37.53 10.19,37.53 7.33,40.39 7.33,43.74 7.15,43.92 3.4,43.92 2.78,43.31 JP1.15 | JP1.15
  Bottom 0.152: v23.23,25.91 23.23,30.91 | 23.23,30.91 v23.23,32.52 | 23.23,30.91 13.22,30.91 v10.01,34.13 10.01,36.81 v10.72,37.53 | v9.29,26.63 9.29,27.7 2.5,34.49 2.5,37.08 JP1.15
A0  (1 unrouted)
A1  (1 unrouted)
A2  (1 unrouted)
A3  (1 unrouted)
A4  (1 unrouted)
A5  (1 unrouted)
AREF  (2 unrouted)
D+  (1 unrouted)
D-  (1 unrouted)
EN  (via drill 0.35)
  Top 0.152: 11.26,23.59 11.79,24.12 11.79,25.91 12.33,26.45 15.37,26.45 16.8,27.88 18.05,27.88 R6.1 | 11.26,23.59 11.26,22.87 U2.3 | 11.26,23.59 v10.72,24.12
  Bottom 0.152: v10.72,24.12 8.94,24.12 7.5,22.7 7.5,19.12 JP3.2
FM_ANT  (1 unrouted)
GND  (via drill 0.35)  (9 unrouted)
  Top 0.152: 5.18,35.56 5.18,34.67 3.93,33.42 3.75,33.42 2.68,32.34 2.68,31.81 U3.2 | 5.18,35.56 4.47,36.28 6.61,38.42 7.86,38.42 11.26,35.02 | JP1.13 2.2,35.67 X1.1 5.18,35.56 | 5.54,26.27 5.9,26.63 C14.2 5.54,26.27 | 5.54,26.27 5,25.73 3.57,25.73 2.68,26.63 2.68,28.23 D2.2 | 7.5,29.31 9.29,29.31 9.83,29.84 10.54,29.84 11.08,29.31 11.08,28.06 C9.2 11.26,27.88 12.33,26.8 13.76,26.8 14.83,27.88 C3.2 15.01,28.06 15.01,30.38 C8.2 14.83,30.56 13.76,31.63 13.58,31.63 12.33,32.88 C7.2 12.15,33.06 12.15,34.13 11.26,35.02 | 7.5,29.31 7.33,29.31 C2.2 7.5,29.31 | 5.54,26.27 6.25,25.55 v6.43,25.55 | 7.5,29.31 v7.5,27.7 7.5,25.73 9.47,23.77 9.65,23.77 10.01,23.41 10.01,22.87 U2.2 10.01,22.7 10.01,21.27 | 5,10.19 7.5,10.19 U1.87 7.68,10.19 10.19,10.19 U1.88 10.37,10.19 12.69,10.19 U1.83 | U1.57 11.08,4.65 12.33,4.65 U1.58 12.51,4.83 12.51,6.97 12.69,7.15 | 12.69,7.15 10.37,7.15 U1.81 10.19,7.15 7.68,7.15 U1.80 7.5,7.15 5,7.15 U1.79 5,7.33 5,10.01 U1.78 5,10.19 | 12.69,7.15 U1.82 | U1.67 15.19,14.3 13.94,14.3 12.87,13.22 U1.84 12.69,13.22 10.37,13.22 U1.85 | 9.47,13.22 10.19,13.22 U1.85 | 9.47,13.22 7.68,13.22 U1.86 | 10.01,21.27 9.11,20.37 C4.2 | 11.44,20.37 10.9,20.37 10.01,21.27 | 11.44,20.37 12.69,20.37 X4.2 | 2.68,13.22 2.68,14.3 U1.44 2.68,14.47 2.68,15.73 | 2.68,13.22 2.68,13.04 U1.45 2.68,13.22 | 2.68,15.73 3.93,15.73 U1.76 4.11,15.73 4.65,16.26 4.65,16.44 5.36,17.16 U1.39 5.54,17.33 6.61,17.33 U1.38 6.79,17.33 8.04,17.33 U1.37 8.22,17.16 8.22,15.73 | U1.41 2.68,17.16 2.68,15.9 U1.43 2.68,15.73 | 2.68,13.22 4.83,13.22 U1.77 5,13.04 5,10.19 | 8.22,15.73 9.47,15.73 U1.72
  Top 0.152: U1.72 9.65,15.73 10.9,15.73 U1.71 11.08,15.73 11.08,17.16 U1.35 11.08,17.33 11.44,17.69 11.44,20.37 | 8.22,15.73 U1.73 | 9.47,13.22 9.47,15.55 U1.72 | 9.47,13.22 U1.85 | 20.91,5.9 18.59,3.57 18.59,2.32 X2.GND@1 | 20.91,5.9 20.91,10.01 19.12,11.79 | 19.12,11.79 18.76,11.79 X2.GND 19.12,11.79 | 18.59,16.08 18.59,14.83 19.84,13.58 19.84,12.51 19.12,11.79 | 18.59,16.08 18.59,17.33 X2.GND@4 | 20.91,5.9 24.84,1.97 34.13,1.97 X2.GND@2 | IC1.15 30.2,28.23 31.63,28.23 31.99,28.59 X3.SPRT@2 32.17,28.77 33.24,29.84 33.24,32.88 NETSTAT.C 33.24,33.06 33.24,34.85 31.45,36.63 31.45,36.81 30.2,38.06 C5.2 30.2,38.24 30.91,38.96 30.91,40.49 D5.A | X2.GND@3 35.38,17.87 35.38,18.76 32.17,21.98 X3.SPRT@1 31.99,22.16 31.63,22.52 30.56,22.52 L.C 30.38,22.52 29.48,21.62 27.34,21.62 25.91,23.05 25.91,24.3 25.55,24.66 | 23.05,34.31 21.09,34.31 20.19,35.2 20.19,36.1 18.23,38.06 17.51,38.06 C6.2 17.33,38.24 17.33,40.03 15.9,41.46 15.19,41.46 14.47,40.74 14.47,38.24 11.26,35.02 | 23.05,34.31 23.23,34.31 R9.1 23.05,34.31 | 25.55,24.66 25.38,24.48 24.84,24.48 24.3,23.95 24.3,22.7 PWRSTAT.C 24.12,22.7 21.8,22.7 | 25.55,24.66 26.09,25.2 26.09,25.73 IC1.5 | 21.8,22.7 21.44,22.7 | 21.44,22.7 20.01,22.7 R8.2 | X4.1 12.87,23.05 12.87,23.41 14.83,25.38 C1.2 15.01,25.55 16.8,25.55 17.51,26.27 21.8,26.27 | 29.13,34.31 29.13,35.38 Y1.2 | 29.13,34.31 29.13,32.7 IC1.23 29.13,32.52 29.13,32.17 28.95,31.99 24.3,31.99 23.95,31.63 23.95,30.91 | 23.95,30.91 23.95,27.52 23.59,27.16 23.23,27.16 IC1.43 23.05,27.16 22.7,27.16 21.8,26.27 | 23.95,30.91 23.59,31.27 23.23,31.27 IC1.35 23.05,31.27 22.7,31.27 21.09,29.66 17.51,29.66 17.33,29.84 17.33,30.56 14.47,33.42 14.47,34.13 SJ1.1
  Top 0.152: 21.8,26.27 21.8,22.7 | 23.05,34.31 23.05,36.1 23.59,36.63 25.2,36.63 27.52,34.31 29.13,34.31 | 18.59,16.08 20.01,16.08 21.44,17.51 21.44,22.7 | X3.BASE@1 35.02,24.66 35.02,26.09 X3.BASE@2
  Bottom 0.152: v6.43,25.55 6.43,26.63 v7.5,27.7 | X3.SPRT@2 31.99,28.59 31.45,28.06 31.45,26.63 31.63,26.45 31.63,23.95 31.45,23.77 31.45,22.7 31.99,22.16 X3.SPRT@1
GSM_ANT  (via drill 0.35)
  Top 0.152: v14.65,24.12 14.3,23.77 14.3,21.62 X4.3 | v10.19,25.91 v10.19,29.13 | v4.83,20.55 3.93,19.66 3.93,17.33 U1.40
  Bottom 0.152: v14.65,24.12 14.65,24.66 v10.19,29.13 | v4.83,20.55 v10.19,25.91
KEY  (via drill 0.35)
  Top 0.152: v11.79,36.81 10.37,36.81 9.24,37.93 D7.C | v13.22,35.38 15.19,35.38 15.55,35.02 15.55,34.85 16.08,34.31 SJ1.2
  Bottom 0.152: v11.79,36.81 v13.22,35.38 22.16,35.38 31.27,26.27 31.27,25.55 31.09,25.38 31.09,20.37 31.63,19.84 31.63,15.19 18.59,2.14 17.16,2.14 10.54,8.76 8.69,8.76 JP1.1
MIC2+  (1 unrouted)
MIC2-  (1 unrouted)
MISO  (1 unrouted)
MOSI  (1 unrouted)
N$1  (1 unrouted)
N$2  (1 unrouted)
N$3  (1 unrouted)
N$4  (1 unrouted)
N$5  (1 unrouted)
N$6  (1 unrouted)
N$7  (1 unrouted)
N$9  (1 unrouted)
N$11
  Top 0.152: IC1.16 30.02,28.77 29.48,28.77 29.31,28.95 29.31,31.81 30.38,32.88 30.38,35.38 Y1.3
N$12
  Top 0.152: IC1.17 30.2,29.13 30.56,29.13 31.09,29.66 31.09,36.63 30.91,36.81 28.77,36.81 28.06,36.1 28.06,35.56 Y1.1
N$15  (via drill 0.35)
  Top 0.152: v16.08,32.88 18.05,30.91 18.05,30.56 R5.1 | v11.08,34.13 10.37,34.85 9.65,34.85 9.29,34.49 v9.29,31.09 | v15.55,21.62 v15.55,23.59 | v30.02,23.95 31.45,25.38 32.17,25.38 X3.D+
  Bottom 0.152: v16.08,32.88 12.33,32.88 v11.08,34.13 | v9.29,31.09 15.55,24.84 v15.55,23.59 | v15.55,21.62 15.55,21.09 14.12,19.66 14.12,18.59 15.19,17.51 23.05,17.51 24.12,18.59 24.12,19.48 26.8,22.16 27.7,22.16 29.48,23.95 v30.02,23.95
N$16  (1 unrouted)
NETSTAT  (1 unrouted)
PWRSTAT  (1 unrouted)
RST  (via drill 0.35)
  Top 0.152: SW1.1 24.84,37.71 20.91,37.71 SW1.3 20.73,37.71 17.83,37.71 12.51,43.03 12.51,43.74 11.97,44.28 4.91,44.28 JP1.16 | v30.56,25.91 30.91,26.27 30.91,26.98 30.74,27.16 30.2,27.16 IC1.13
  Bottom 0.152: v30.56,25.91 28.95,25.91 25.91,22.87 14.83,22.87 2.86,34.85 2.86,39.15 JP1.16
SCK  (via drill 0.35)
  Top 0.152: v29.13,22.34 29.13,23.05 28.23,23.95 28.23,25.73 IC1.9
  Bottom 0.152: v29.13,22.34 29.13,13.76 18.76,3.4 17.69,3.4 4.74,15.24 JP1.6
SIMCLK  (via drill 0.35)  (1 unrouted)
  Top 0.152: v3.93,29.31 3.93,29.48 3.4,30.02 D2.4 | v18.23,4.47 18.23,5 18.59,5.36 X2.CLK
  Bottom 0.152: v3.93,29.31 3.93,28.41 3.75,28.23 3.75,18.76 18.05,4.47 v18.23,4.47
SIMDATA  (2 unrouted)
SIMRST  (via drill 0.35)  (1 unrouted)
  Top 0.152: v4.47,27.88 4.11,28.23 3.4,28.23 D2.3 | v20.19,6.97 19.3,7.86 18.76,7.86 X2.RST
  Bottom 0.152: v4.47,27.88 4.47,28.77 4.65,28.95 4.65,29.66 4.29,30.02 3.57,30.02 3.22,29.66 3.22,18.41 17.87,3.75 18.59,3.75 20.19,5.36 v20.19,6.97
SPEAKER2+  (1 unrouted)
SPEAKER2-
  Top 0.152: U1.11 2.68,3.04 2.68,2.68 3.93,1.43 X6.2
UART_DTR  (1 unrouted)
UART_RTS  (1 unrouted)
UART_RXD
  Top 0.152: U1.31 16.62,17.33 16.62,19.48 17.33,20.19 17.69,20.19 D9.A
VBAT  (via drill 0.35)  (2 unrouted)
  Top 0.152: D4.A 27.02,41.13 D5.C 28.23,39.81 28.23,38.24 C5.1 28.23,38.06 v26.09,38.06 | JP3.1 5,19.12 6.08,20.19 C4.1 6.25,20.37 6.25,23.05 7.15,23.95 7.15,26.98 5.54,28.59 5.54,29.13 C2.1 | U3.3 3.57,31.63 3.57,31.09 5.36,29.31 C2.1 | 8.04,30.38 6.61,30.38 5.54,29.31 C2.1 | 8.04,30.38 10.54,30.38 12.87,28.06 C3.1 | 7.5,35.56 7.5,33.06 8.04,32.52 8.04,30.38 | 7.5,35.56 v8.58,36.63 | 7.5,35.56 X1.2
  Bottom 0.152: v26.09,38.06 11.26,38.06 11.08,38.24 10.19,38.24 v8.58,36.63
VBUS  (via drill 0.35)  (2 unrouted)
  Top 0.152: v8.22,22.34 8.58,22.7 9.11,22.7 U2.1 | v26.63,24.66 27.16,25.2 IC1.7 | v25.2,23.77 25.2,23.23 27.7,20.73 | 27.7,20.73 27.88,20.55 CHG.A 27.7,20.73 | v20.91,26.98 20.01,27.88 R6.2 | v4.11,35.56 3.57,35.02 3.57,34.49 U3.4 | v17.33,41.99 19,41.99 D4.C | v15.55,40.74 15.55,38.24 C6.1 | v24.12,16.08 26.8,18.76 26.8,19.84 27.7,20.73
  Bottom 0.152: v8.22,22.34 8.22,20.91 10.01,19.12 JP3.3 10.19,18.94 11.08,18.94 13.94,16.08 v24.12,16.08 | v26.63,24.66 26.09,24.66 v25.2,23.77 24.12,23.77 v20.91,26.98 18.76,29.13 13.94,29.13 7.5,35.56 | 7.5,35.56 v4.11,35.56 | 15.55,41.99 12.87,41.99 7.5,36.63 7.5,35.56 | 15.55,41.99 v17.33,41.99 | 15.55,41.99 v15.55,40.74
VRTC  (1 unrouted)